# Altium schematic sheet Op-Amp Stages.SchDoc
size A; SheetNumber: 2; SheetTotal: 3
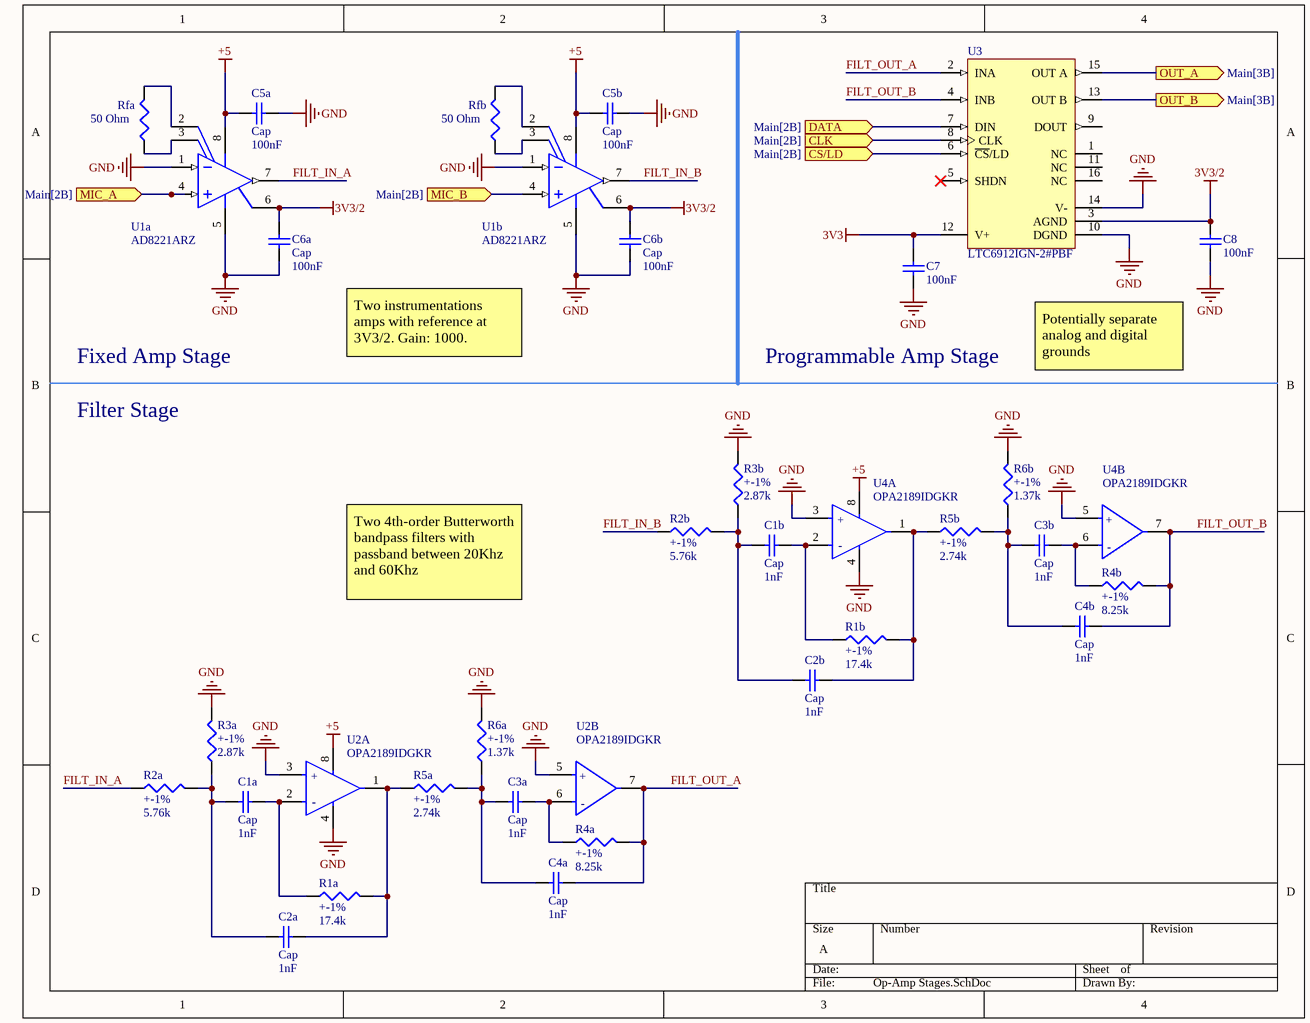
[diagram p0: Op-Amp Stages.SchDoc]

## Parts
C1a  Cap  value 1nF  [RAD-0.3]
C1b  Cap  value 1nF  [RAD-0.3]
C2a  Cap  value 1nF  [RAD-0.3]
C2b  Cap  value 1nF  [RAD-0.3]
C3a  Cap  value 1nF  [RAD-0.3]
C3b  Cap  value 1nF  [RAD-0.3]
C4a  Cap  value 1nF  [RAD-0.3]
C4b  Cap  value 1nF  [RAD-0.3]
C5a  Cap  value 100nF  [RAD-0.3]
C5b  Cap  value 100nF  [RAD-0.3]
C6a  Cap  value 100nF  [RAD-0.3]
C6b  Cap  value 100nF  [RAD-0.3]
C7  100nF  [RAD-0.3]
C8  100nF  [RAD-0.3]
R1a  +-1%  value 17.4k  [J1-0603]
R1b  +-1%  value 17.4k  [J1-0603]
R2a  +-1%  value 5.76k  [J1-0603]
R2b  +-1%  value 5.76k  [J1-0603]
R3a  +-1%  value 2.87k  [J1-0603]
R3b  +-1%  value 2.87k  [J1-0603]
R4a  +-1%  value 8.25k  [J1-0603]
R4b  +-1%  value 8.25k  [J1-0603]
R5a  +-1%  value 2.74k  [J1-0603]
R5b  +-1%  value 2.74k  [J1-0603]
R6a  +-1%  value 1.37k  [J1-0603]
R6b  +-1%  value 1.37k  [J1-0603]
Rfa  50 Ohm  [J1-0603]
Rfb  50 Ohm  [J1-0603]
U1a  AD8221ARZ  [ADI-R-8_M]
U1b  AD8221ARZ  [ADI-R-8_M]
U2  OPA2189IDGKR  [FP-DGK0008A-IPC_B]  (parts A,B of 2)
U3  LTC6912IGN-2#PBF  [LT-GN-16_L]
U4  OPA2189IDGKR  [FP-DGK0008A-IPC_B]  (parts A,B of 2)

## Ports
CLK (in, see Main[2B]), CS/LD (in, see Main[2B]), DATA (in, see Main[2B]), MIC_A (in, see Main[2B]), MIC_B (in, see Main[2B]), OUT_A (out, see Main[3B]), OUT_B (out, see Main[3B])

## Nets
3V3: C7.2 U3.12(V+)
3V3/2: C6a.2 C6b.2 C8.2 U1a.6(REF) U1b.6(REF) U3.3(AGND)
+5: C5a.1 C5b.1 U1a.8(VS+) U1b.8(VS+) U2.8(V+) U4.8(V+)
GND: C5a.2 C5b.2 C6a.1 C6b.1 C7.1 C8.1 R3a.2 R3b.2 R6a.2 R6b.2 U1a.1(IN-) U1a.5(VS-) U1b.1(IN-) U1b.5(VS-) U2.3(+IN_A) U2.4(V-) U2.5(+IN_B) U3.10(DGND) U3.14(V-) U4.3(+IN_A) U4.4(V-) U4.5(+IN_B)
CLK: U3.8(CLK) ; port CLK
CS/LD: U3.6(~{CS}/LD) ; port CS/LD
DATA: U3.7(DIN) ; port DATA
FILT_IN_A: R2a.1 U1a.7(VOUT)
FILT_IN_B: R2b.1 U1b.7(VOUT)
FILT_OUT_A: C4a.2 R4a.2 U2.7(OUT_B) U3.2(INA)
FILT_OUT_B: C4b.2 R4b.2 U3.4(INB) U4.7(OUT_B)
MIC_A: U1a.4(IN+) ; port MIC_A
MIC_B: U1b.4(IN+) ; port MIC_B
OUT_A: U3.15(OUT_A) ; port OUT_A
OUT_B: U3.13(OUT_B) ; port OUT_B
NetC1a_1: C1a.1 C2a.1 R2a.2 R3a.1
NetC1a_2: C1a.2 R1a.1 U2.2(-IN_A)
NetC1b_1: C1b.1 C2b.1 R2b.2 R3b.1
NetC1b_2: C1b.2 R1b.1 U4.2(-IN_A)
NetC2a_2: C2a.2 R1a.2 R5a.1 U2.1(OUT_A)
NetC2b_2: C2b.2 R1b.2 R5b.1 U4.1(OUT_A)
NetC3a_1: C3a.1 C4a.1 R5a.2 R6a.1
NetC3a_2: C3a.2 R4a.1 U2.6(-IN_B)
NetC3b_1: C3b.1 C4b.1 R5b.2 R6b.1
NetC3b_2: C3b.2 R4b.1 U4.6(-IN_B)
NetRfa_1: Rfa.1 U1a.3(RG)
NetRfa_2: Rfa.2 U1a.2(RG)
NetRfb_1: Rfb.1 U1b.3(RG)
NetRfb_2: Rfb.2 U1b.2(RG)

Not connected (* = marked no-connect by the designer): U3 1(NC) 5(SHDN)* 9(DOUT) 11(NC) 16(NC)

## Notes on the sheet
- Fixed Amp Stage
- Two instrumentations amps with reference at 3V3/2. Gain: 1000.
- Programmable Amp Stage
- Potentially separate analog and digital grounds
- Filter Stage
- Two 4th-order Butterworth bandpass filters with passband between 20Khz and 60Khz
- (in symbol CMP-04895-000407-1, part A) +; -
- (in symbol CMP-04895-000407-1, part B) +; -

## Library data of the parts
C1a C1b C2a C2b C3a C3b C4a C4b C5a C5b C6a C6b C7 C8 = Cap: Capacitor; Published: 8-Jun-2000; LatestRevisionDate: 17-Jul-2002; LatestRevisionNote: Re-released for DXP Platform.; PackageReference: RAD-0.3; Publisher: Altium Limited; PackageDescription: Radial Cap, Thru-Hole; 2 Leads; 0.3 in Pin Spacing
R1a R1b R2a R2b R3a R3b R4a R4b R5a R5b R6a R6b Rfa Rfb = Res3: Resistor; Published: 8-Jun-2000; LatestRevisionDate: 29-May-2009; LatestRevisionNote: IPC-7351 Footprint Added.; PackageReference: J1-0603; Publisher: Altium Limited; PackageDescription: Chip Resistor
U1a U1b = CMP-0934-00045-1: Precision Instrumentation Amplifier, 2 V/us, -40 to 125 degC, 8-Pin SOIC (R-8), RoHS, Tube; Manufacturer: Analog Devices; Quiescent Current: 0.9 mA Typ.; Slew Rate@G: 1=2 V/us Typ.; -3dB Bandwidth@G: 1=825 kHz; VIO: 60 uV Max.; PackageDescription: 8-Pin Standard Small Outline Package, Body 4.9 x 3.9 mm, Pitch 1.27 mm; PackageVersion: Jun-06; Mounting Technology: Surface Mount; ComponentLink1Description: Manufacturer URL; ComponentLink1URL: http://www.analog.com/en/index.html; RoHS: TRUE; ComponentLink2URL: http://www.analog.com/static/imported-files/data_sheets/AD8221.pdf; DatasheetVersion: Rev. C; ComponentLink3Description: Package Specification; Packing: Tube; Temperature Range: -40 to 125 degC; ComponentLink3URL: http://www.analog.com/static/imported-files/packages/PKG_PDF/SOIC_Narrow%20(R)/R_8.pdf; ComponentLink2Description: Datasheet; PartNumber: AD8221ARZ
U2 U4 = CMP-04895-000407-1: DUAL, 14MHZ, MUX-FRIENDLY, LOW-N; Number of Channels: 1; Max Operating Temperature: 125°C; Min Operating Temperature: -40°C; RoHS Compliant: Yes
U3 = CMP-0359-00259-2: Dual Channel, Dual Programmable Gain Amplifier with Serial Digital Interface, 30 MHz Typical GBW, 16 V/us Typical SR, 2.7 to 10.5 V, 16-Pin SOP (GN-16), Industrial, Pb-Free; Manufacturer: Linear Technology; Linear Technology Part Number: LTC6912-2; Is (mA) Typical: 1.75; Vos (mV) Typical: 2; GBW (MHz) Typical: 30; SR (V/us) Typical: 16; Vs Max (V): 10.5; Vs Min (V): 2.7; Type: PGA; RevisionNote: URLs updated; DatasheetVersion: Rev. A; PackageDescription: 16-Lead Plastic SSOP, Body 4.9 x 3.9 mm, Pitch 0.635 mm; PartNumber: LTC6912IGN-2#PBF; ComponentLink3URL: http://cds.linear.com/docs/en/packaging/05081641_B_GN16.pdf; RoHS: Pb-Free; PackageVersion: Rev B; ComponentLink1URL: http://www.linear.com/; ComponentLink2URL: http://cds.linear.com/docs/en/datasheet/6912fa.pdf; ComponentLink2Description: Datasheet; Channels (#): 2; Mounting Technology: Surface Mount; ComponentLink1Description: Manufacturer URL; ComponentLink3Description: Package Specification; PackageReference: LT-GN-16